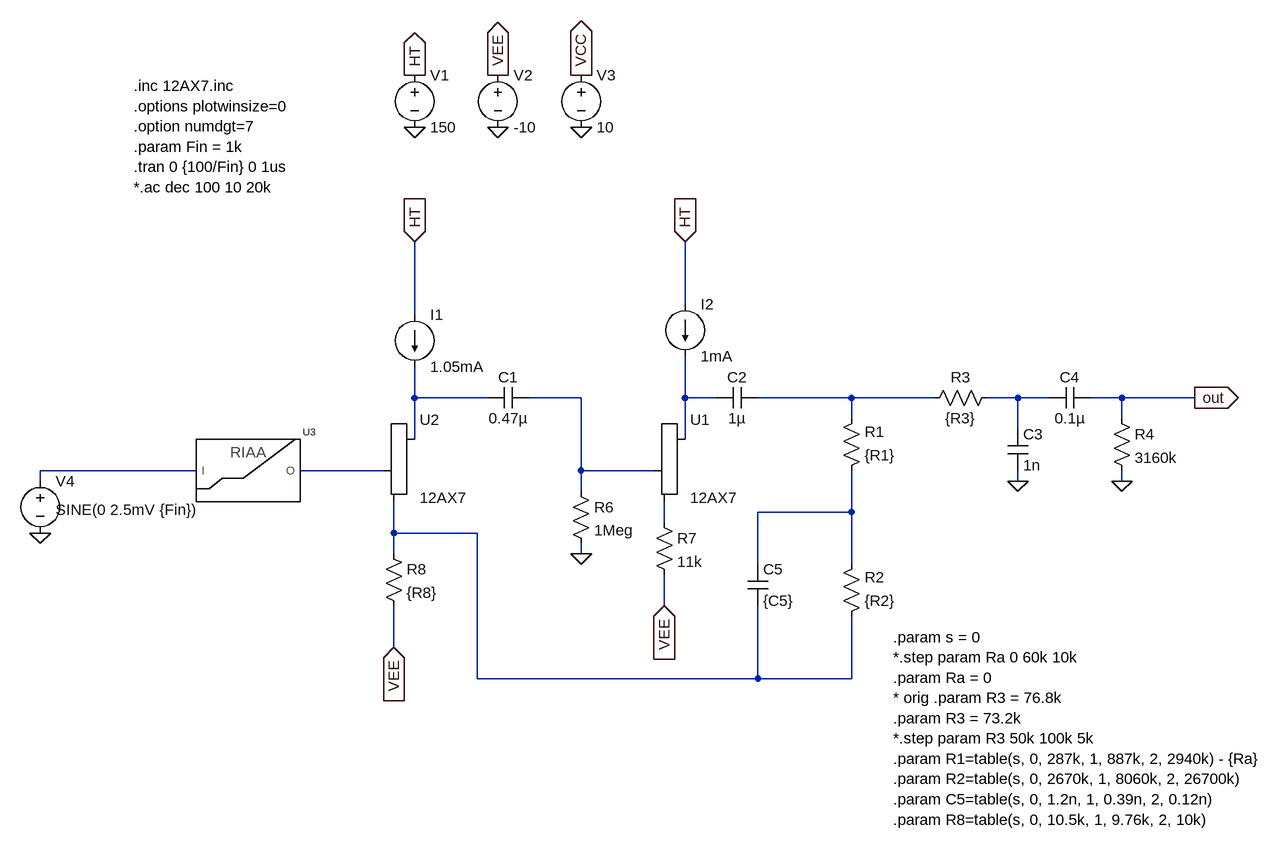
[diagram p0: schematic Tube phono.asc]
Tube phono.asc, the LTspice schematic file:
Version 4
SHEET 1 1088 1120
WIRE -1488 -464 -1488 -560
WIRE -1904 -448 -1904 -560
WIRE -1904 -320 -1904 -368
WIRE -1792 -320 -1904 -320
WIRE -1648 -320 -1728 -320
WIRE -1488 -320 -1488 -384
WIRE -1440 -320 -1488 -320
WIRE -1232 -320 -1376 -320
WIRE -1104 -320 -1232 -320
WIRE -976 -320 -1024 -320
WIRE -928 -320 -976 -320
WIRE -816 -320 -864 -320
WIRE -704 -320 -816 -320
WIRE -1232 -288 -1232 -320
WIRE -816 -288 -816 -320
WIRE -976 -272 -976 -320
WIRE -1904 -256 -1904 -320
WIRE -1488 -256 -1488 -320
WIRE -2240 -208 -2480 -208
WIRE -1952 -208 -2080 -208
WIRE -1648 -208 -1648 -320
WIRE -1536 -208 -1648 -208
WIRE -2480 -192 -2480 -208
WIRE -976 -192 -976 -208
WIRE -816 -192 -816 -208
WIRE -1648 -176 -1648 -208
WIRE -1232 -144 -1232 -208
WIRE -1232 -144 -1376 -144
WIRE -1520 -128 -1520 -160
WIRE -1936 -112 -1936 -160
WIRE -1808 -112 -1936 -112
WIRE -1936 -80 -1936 -112
WIRE -1648 -80 -1648 -96
WIRE -1376 -64 -1376 -144
WIRE -1232 -64 -1232 -144
WIRE -1520 0 -1520 -48
WIRE -1936 64 -1936 0
WIRE -1808 112 -1808 -112
WIRE -1376 112 -1376 0
WIRE -1376 112 -1808 112
WIRE -1232 112 -1232 16
WIRE -1232 112 -1376 112
FLAG -1904 -736 0
FLAG -1904 -816 HT
IOPIN -1904 -816 Out
FLAG -1776 -736 0
FLAG -1776 -816 VEE
IOPIN -1776 -816 Out
FLAG -1648 -736 0
FLAG -1648 -816 VCC
IOPIN -1648 -816 Out
FLAG -1904 -560 HT
IOPIN -1904 -560 In
FLAG -1936 64 VEE
IOPIN -1936 64 In
FLAG -976 -192 0
FLAG -816 -192 0
FLAG -1648 -80 0
FLAG -1520 0 VEE
IOPIN -1520 0 In
FLAG -704 -320 out
IOPIN -704 -320 Out
FLAG -2480 -112 0
FLAG -1488 -560 HT
IOPIN -1488 -560 In
SYMBOL voltage -1904 -832 R0
SYMATTR InstName V1
SYMATTR Value 150
SYMBOL voltage -1776 -832 R0
SYMATTR InstName V2
SYMATTR Value -10
SYMBOL voltage -1648 -832 R0
SYMATTR InstName V3
SYMATTR Value 10
SYMBOL Misc/triode -1904 -208 R0
SYMATTR InstName U2
SYMATTR Value 12AX7
SYMBOL res -1248 -192 M180
WINDOW 0 36 76 Left 2
WINDOW 3 36 40 Left 2
SYMATTR InstName R1
SYMATTR Value {R1}
SYMBOL res -1248 32 M180
WINDOW 0 36 76 Left 2
WINDOW 3 36 40 Left 2
SYMATTR InstName R2
SYMATTR Value {R2}
SYMBOL cap -1392 0 M180
WINDOW 0 24 56 Left 2
WINDOW 3 24 8 Left 2
SYMATTR InstName C5
SYMATTR Value {C5}
SYMBOL res -1008 -336 R90
WINDOW 0 0 56 VBottom 2
WINDOW 3 32 56 VTop 2
SYMATTR InstName R3
SYMATTR Value {R3}
SYMBOL cap -992 -272 R0
SYMATTR InstName C3
SYMATTR Value 1n
SYMBOL res -832 -304 R0
SYMATTR InstName R4
SYMATTR Value 3160k
SYMBOL Misc/triode -1488 -208 R0
SYMATTR InstName U1
SYMATTR Value 12AX7
SYMBOL res -1664 -192 R0
SYMATTR InstName R6
SYMATTR Value 1Meg
SYMBOL res -1536 -144 R0
SYMATTR InstName R7
SYMATTR Value 11k
SYMBOL cap -1728 -336 R90
WINDOW 0 0 32 VBottom 2
WINDOW 3 32 32 VTop 2
SYMATTR InstName C1
SYMATTR Value 0.47µ
SYMBOL current -1488 -464 R0
SYMATTR InstName I2
SYMATTR Value 1mA
SYMBOL voltage -2480 -208 R0
WINDOW 3 24 60 Left 2
SYMATTR Value SINE(0 2.5mV {Fin})
SYMATTR Value2 AC 1mV
SYMATTR InstName V4
SYMBOL cap -864 -336 R90
WINDOW 0 0 32 VBottom 2
WINDOW 3 32 32 VTop 2
SYMATTR InstName C4
SYMATTR Value 0.1µ
SYMBOL res -1952 -96 R0
SYMATTR InstName R8
SYMATTR Value {R8}
SYMBOL current -1904 -448 R0
SYMATTR InstName I1
SYMATTR Value 1.05mA
SYMBOL cap -1376 -336 R90
WINDOW 0 0 32 VBottom 2
WINDOW 3 32 32 VTop 2
SYMATTR InstName C2
SYMATTR Value 1µ
SYMBOL Misc_Add/RefRIAA -2160 -208 R0
SYMATTR InstName U3
TEXT -2336 -800 Left 2 !.inc 12AX7.inc\n.options plotwinsize=0\n.option numdgt=7\n.param Fin = 1k\n.tran 0 {100/Fin} 0 1us\n*.ac dec 100 10 20k
TEXT -1168 48 Left 2 !.param s = 0\n*.step param Ra 0 60k 10k\n.param Ra = 0\n* orig .param R3 = 76.8k\n.param R3 = 73.2k\n*.step param R3 50k 100k 5k\n.param R1=table(s, 0, 287k, 1, 887k, 2, 2940k) - {Ra}\n.param R2=table(s, 0, 2670k, 1, 8060k, 2, 26700k)\n.param C5=table(s, 0, 1.2n, 1, 0.39n, 2, 0.12n)\n.param R8=table(s, 0, 10.5k, 1, 9.76k, 2, 10k)

The netlist it stands for:
* Tube phono.asc
V1 HT 0 150
V2 VEE 0 -10
V3 VCC 0 10
XU2 N001 N007 N010 12AX7
R1 N008 N004 {R1}
R2 N010 N008 {R2}
C5 N010 N008 {C5}
R3 N005 N004 {R3}
C3 N005 0 1n
R4 out 0 3160k
XU1 N003 N002 N009 12AX7
R6 N002 0 1Meg
R7 N009 VEE 11k
C1 N002 N001 0.47µ
I2 HT N003 1mA
V4 N006 0 SINE(0 2.5mV {Fin}) AC 1mV
C4 out N005 0.1µ
R8 N010 VEE {R8}
I1 HT N001 1.05mA
C2 N004 N003 1µ
XU3 N006 N007 REF_RIAA  ; pins I O
.inc 12AX7.inc
.options plotwinsize=0
.option numdgt=7
.param Fin = 1k
.tran 0 {100/Fin} 0 1us
*.ac dec 100 10 20k
.param s = 0
*.step param Ra 0 60k 10k
.param Ra = 0
* orig .param R3 = 76.8k
.param R3 = 73.2k
*.step param R3 50k 100k 5k
.param R1=table(s, 0, 287k, 1, 887k, 2, 2940k) - {Ra}
.param R2=table(s, 0, 2670k, 1, 8060k, 2, 26700k)
.param C5=table(s, 0, 1.2n, 1, 0.39n, 2, 0.12n)
.param R8=table(s, 0, 10.5k, 1, 9.76k, 2, 10k)
.lib RefRIAA.lib
.backanno
.end